# Altium schematic sheet 09 FLEXSPI FLASH.SchDoc
size 513 x 386 mm
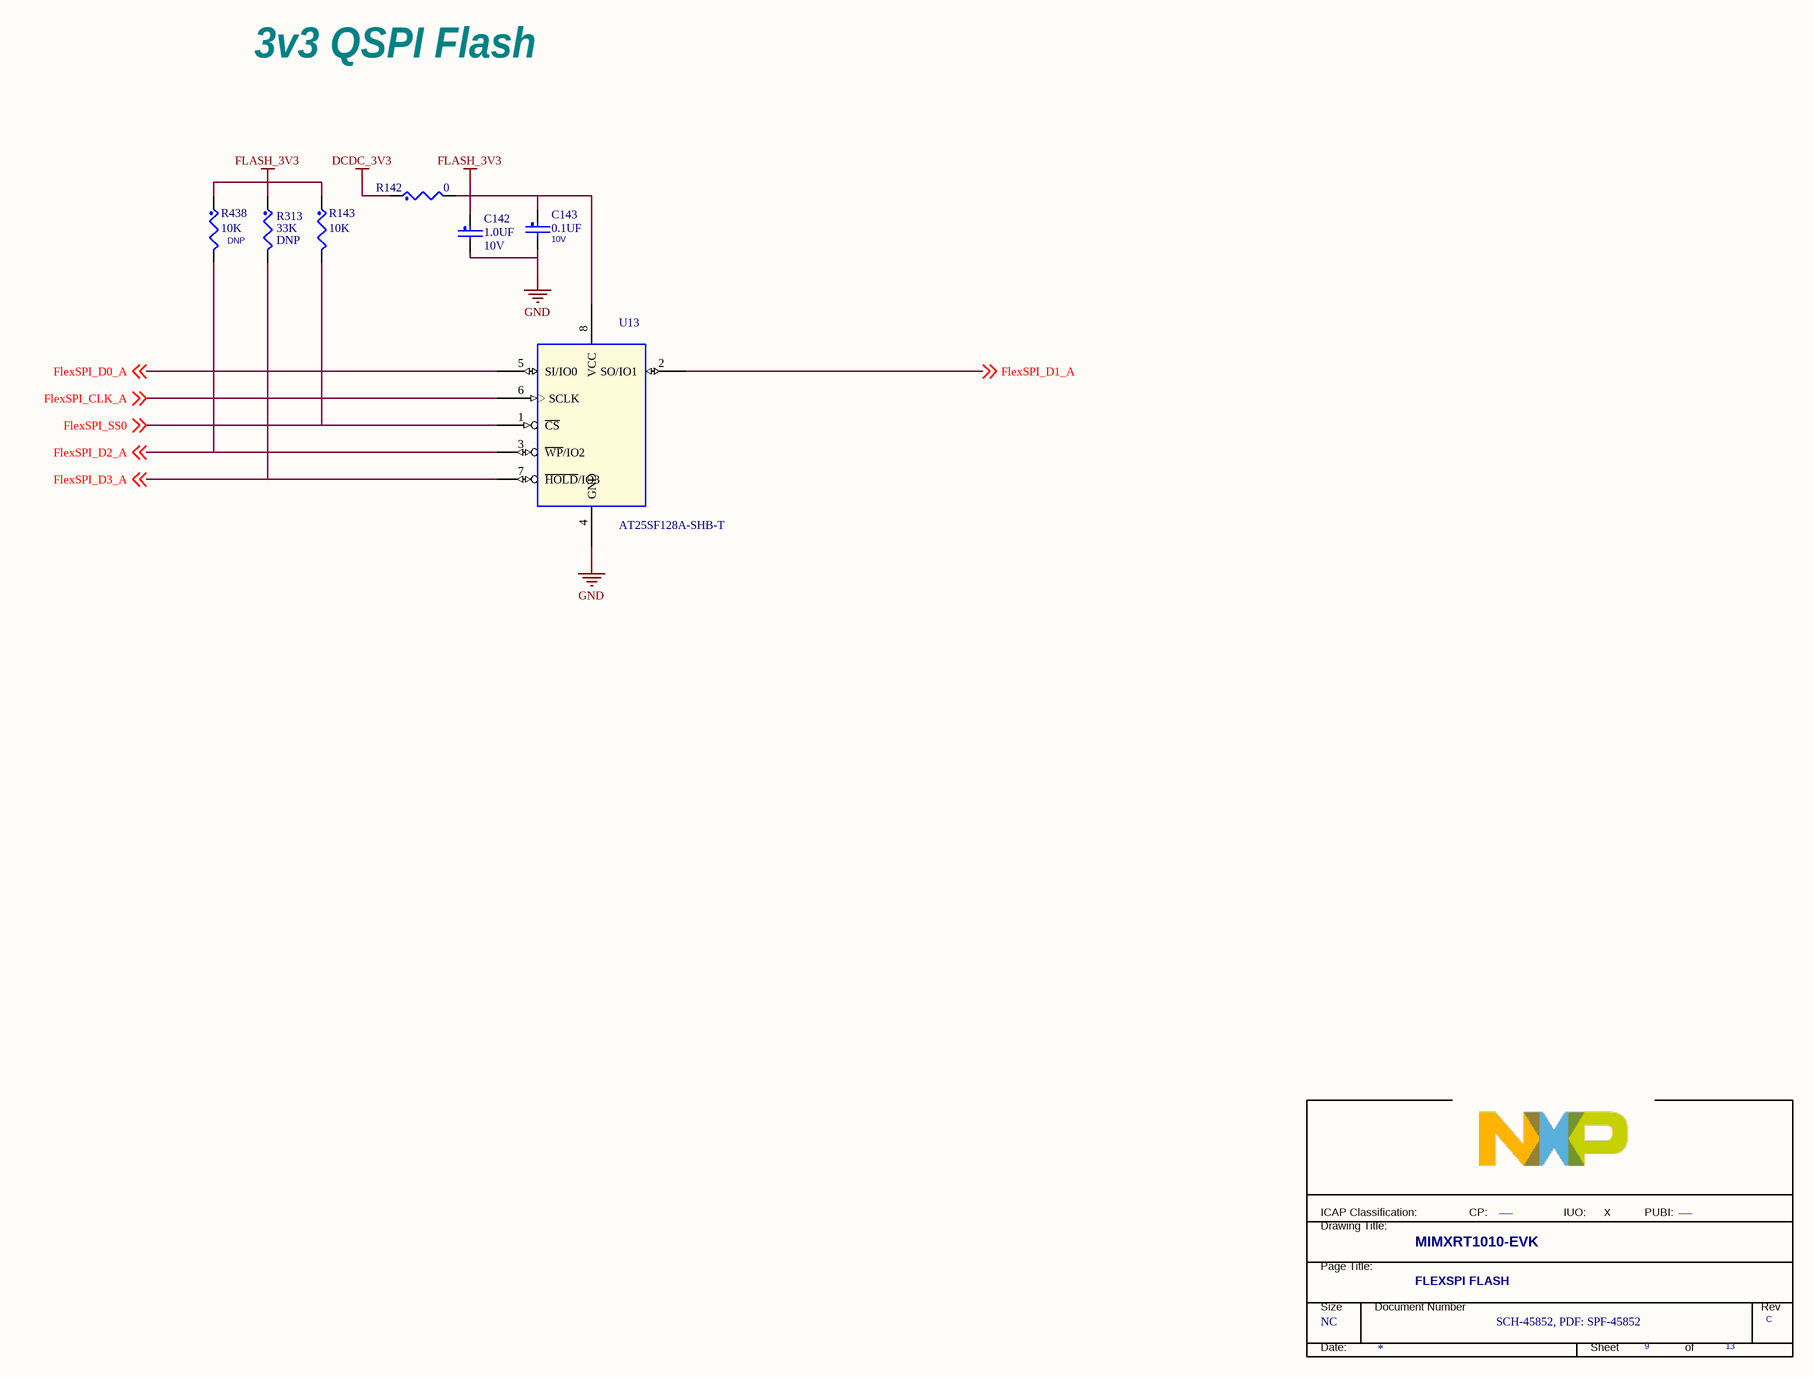
[diagram p0: 09 FLEXSPI FLASH.SchDoc]

## Parts
*  PUBI: ___  Doc: SCH-45852, PDF: SPF-45852  RevCode: C  Title: MIMXRT1010-EVK  Page Size: NC  Page Number: 9  Page Count: 13  PageTitle: FLEXSPI FLASH  (hidden comment: TitleBlock_FS)  (graphical)
C142  1.0UF  voltage rating: 10V  [0402_CC]
C143  0.1UF  VOLTAGE: 10V  [CC0402_25]
R142  0  [0402_CC]
R143  10K  [0402_CC]
R313  33K  ASSY_OPT: DNP  [RC0402_25]
R438  10K  ASSY_OPT: DNP  [0402_CC]
U13  AT25SF128A-SHB-T  [SO8-25X75-200]

## Nets
DCDC_3V3: R142.1
FLASH_3V3: C142.1 C143.1 R142.2 R143.1 R313.1 R438.1 U13.8(VCC)
GND: C142.2 C143.2 U13.4(GND)
FlexSPI_CLK_A: U13.6(SCLK) ; off-sheet FlexSPI_CLK_A
FlexSPI_D0_A: U13.5(SI/IO0) ; off-sheet FlexSPI_D0_A
FlexSPI_D1_A: U13.2(SO/IO1) ; off-sheet FlexSPI_D1_A
FlexSPI_D2_A: R438.2 U13.3(~{WP}/IO2) ; off-sheet FlexSPI_D2_A
FlexSPI_D3_A: R313.2 U13.7(~{HOLD}/IO3) ; off-sheet FlexSPI_D3_A
FlexSPI_SS0: R143.2 U13.1(~{CS}) ; off-sheet FlexSPI_SS0

## Notes on the sheet
- 3v3 QSPI Flash
- X
- (in symbol TitleBlock_FS) ICAP Classification:; CP:; IUO:; PUBI:; Drawing Title:; Page Title:; Size; Document Number; Rev; Date:; Sheet; of

## Library data of the parts
* = TitleBlock_FS: FIUO: _X_; OrgName: Freescale Semiconductor; OrgAddr1: 6501 William Cannon Drive West; OrgAddr2: Austin, TX 78735-8598; FCP: ___; Page Create Date: March  8, 1995; Page Modify Date: *
C142 = CAP_NP: CAP CER 1.0UF 10V 10% X5R 0402; CLASS: DISCRETE; FPLIST: CC0402_25,CC0402_HD,0402_CC; CAD_APPROVED: Yes; MFG_PN01: CC0402KRX5R6BB105; MFG_NAME01: YAGEO AMERICA; AGILE_PN: 150-75772; PCB Footprint: 0402_CC; VOLTAGE: 10V; HEIGHT: 0.6MM; ROHS: Yes
C143 = CAP_NP: CAP CER 0.1UF 10V 10% X5R 0402; CLASS: DISCRETE; FPLIST: CC0402_25,CC0402_HD,0402_CC; CAD_APPROVED: Yes; MFG_PN01: CC0402KRX5R6BB104; MFG_NAME01: YAGEO AMERICA; AGILE_PN: 150-75634; PCB Footprint: CC0402_25; HEIGHT: 0.64MM; ROHS: Yes; Tolerance: 10%
R142 = RES_Dup1: RES MF ZERO OHM 1/16W 5% 0402; CLASS: DISCRETE; FPLIST: RC0402_25,RC0402_HD,RC0402_X2,0402_CC; CAD_APPROVED: Yes; MFG_PN01: MCR01MZPJ000; MFG_NAME01: ROHM; AGILE_PN: 470-75394; ROHS: Yes; Tolerance: 5%; HEIGHT: 0.45 MM; PCB Footprint: 0402_CC
R143 R438 = RES_Dup1: RES MF 10K 1/16W 5% 0402; CLASS: DISCRETE; AGILE_PN: 470-75557; MFG_NAME01: VISHAY INTERTECHNOLOGY; MFG_PN01: CRCW040210K0JNED; CAD_APPROVED: Yes; FPLIST: RC0402_25,RC0402_HD,0402_CC; HEIGHT: 0.4 MM; TOL: 5%; Tolerance: 5%; ROHS: Yes; PCB Footprint: 0402_CC
R313 = RES_Dup1: RES MF 33K  1/16W 1% 0402; CLASS: DISCRETE; FPLIST: RC0402_25,RC0402_HD,0402_CC; CAD_APPROVED: Yes; Temp_Range: -55¡ãC ~ 155¡ãC; MFG_PN01: RC0402FR-0733KL; MFG_NAME01: YAGEO AMERICA; AGILE_PN: 470-31004; HEIGHT: 0.40 MM; ROHS: Yes; Tolerance: 1%; PCB Footprint: RC0402_25
U13 = AT25SF128A: IC MEM NOR FLASH DUAL/QUAD SPI 128MBIT 133MHZ 2.7-3.6V SOP8; AGILE_PN: 342-00805; MFG_NAME01: Adesto Technologies Corporation, Inc; Temp_Range: -40¡ãC ~ 85¡ãC; CAD_APPROVED: Yes; CLASS: IC; MFG_PN01: AT25SF128A-SHB-T; ROHS: Yes; HEIGHT: 2.16MM; PCB Footprint: SO8-25X75-200